# Altium schematic sheet 12_Coral_Edge_TPU.SchDoc: Coral Edge TPU
size 420 x 297 mm; Author: Lukas Henkel; DocumentNumber: 12; SheetNumber: 12; SheetTotal: 16; DocSize: A3
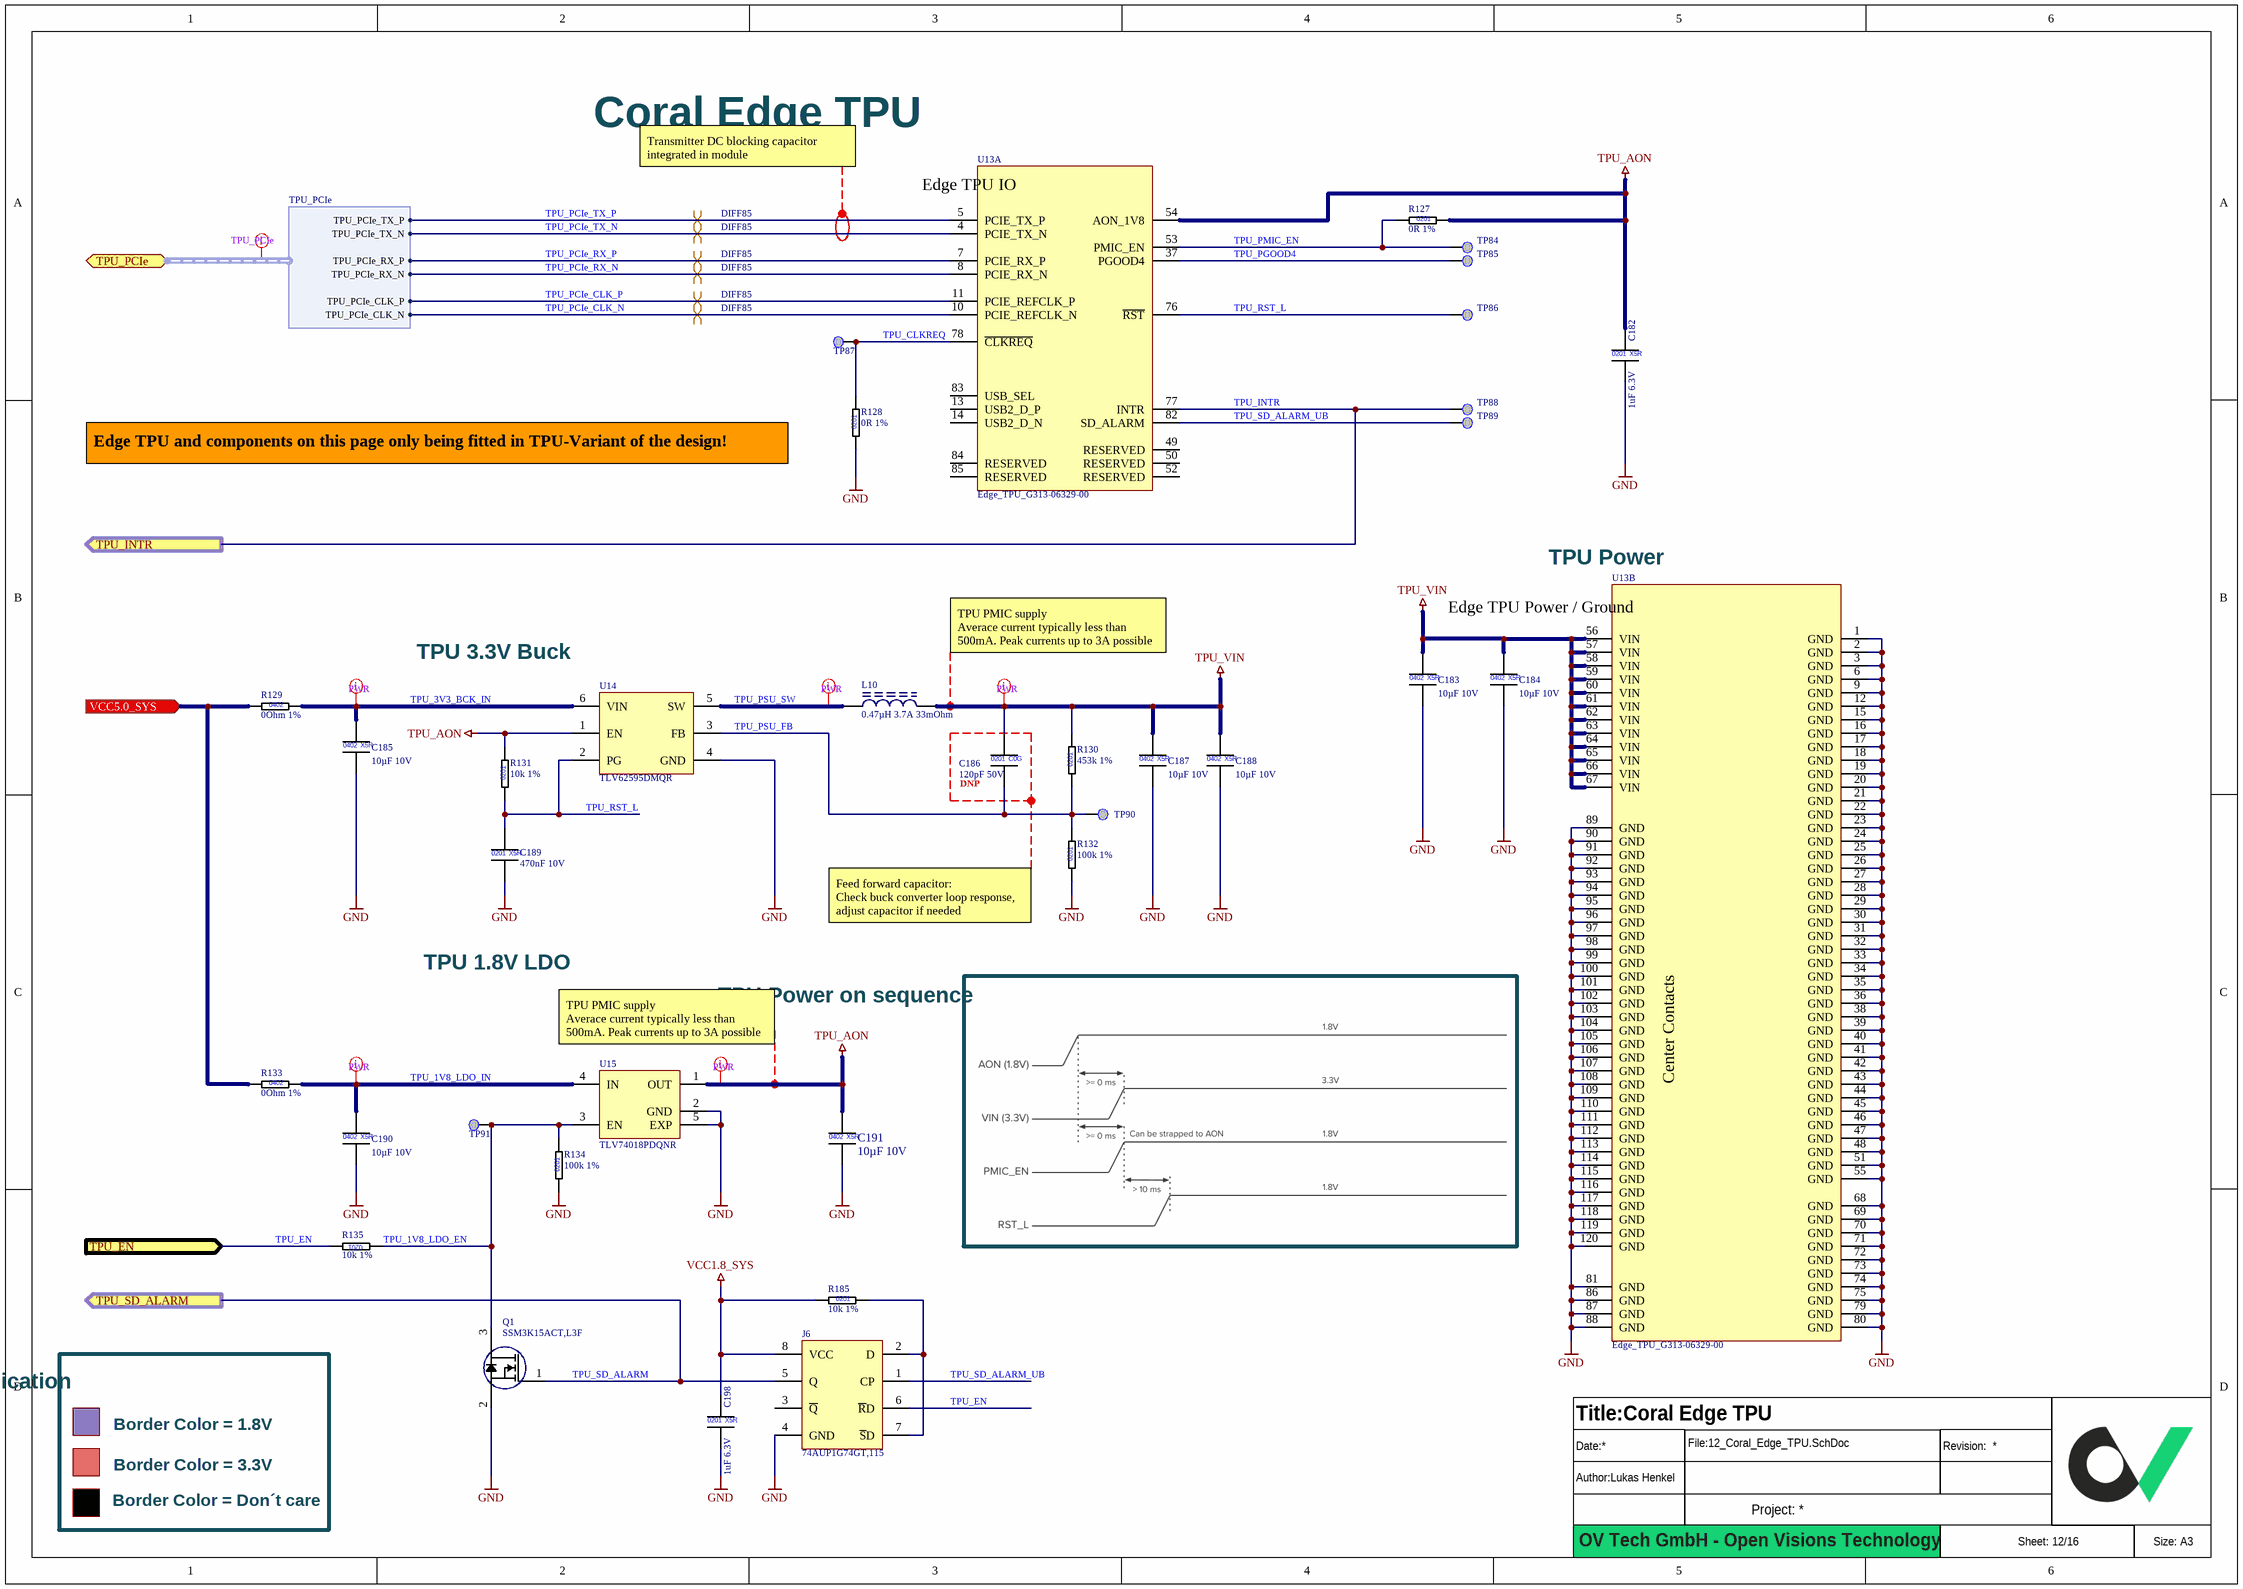
[diagram p0: 12_Coral_Edge_TPU.SchDoc]

## Parts
?  (no value)  (graphical)
C182  1uF 6.3V  [CAPC0603X03L]
C183  10µF 10V  [CAPC1005X06L]
C184  10µF 10V  [CAPC1005X06L]
C185  10µF 10V  [CAPC1005X06L]
C186  120pF 50V  [CAPC0603X03L]
C187  10µF 10V  [CAPC1005X06L]
C188  10µF 10V  [CAPC1005X06L]
C189  470nF 10V  [CAPC0603X03L]
C190  10µF 10V  [CAPC1005X06L]
C191  10µF 10V  [CAPC1005X06L]
C198  1uF 6.3V  [CAPC0603X03L]
J6  74AUP1G74GT,115  [PSON50P100X50-8L]
L10  0.47µH 3.7A 33mOhm  [INDC2016X12L]
Q1  SSM3K15ACT,L3F  [DFN65P100X50-3L]
R127  0R 1%  [RESC0603X03L]
R128  0R 1%  [RESC0603X03L]
R129  0Ohm 1%  [RESC1005X04L]
R130  453k 1%  [RESC0603X03L]
R131  10k 1%  [RESC0603X03L]
R132  100k 1%  [RESC0603X03L]
R133  0Ohm 1%  [RESC1005X04L]
R134  100k 1%  [RESC0603X03L]
R135  10k 1%  [RESC0603X03L]
R185  10k 1%  [RESC0603X03L]
TP84  Testpoint 0.5mm  [TP_0.50mm]  (value not drawn)  (no BOM)
TP85  Testpoint 0.5mm  [TP_0.50mm]  (value not drawn)  (no BOM)
TP86  Testpoint 0.5mm  [TP_0.50mm]  (value not drawn)  (no BOM)
TP87  Testpoint 0.5mm  [TP_0.50mm]  (value not drawn)  (no BOM)
TP88  Testpoint 0.5mm  [TP_0.50mm]  (value not drawn)  (no BOM)
TP89  Testpoint 0.5mm  [TP_0.50mm]  (value not drawn)  (no BOM)
TP90  Testpoint 0.5mm  [TP_0.50mm]  (value not drawn)  (no BOM)
TP91  Testpoint 0.5mm  [TP_0.50mm]  (value not drawn)  (no BOM)
U13  Edge_TPU_G313-06329-00  [LGA120C50P19X22_1000X1500X150]  (parts A,B of 2)
U14  TLV62595DMQR  [VSON50P150X150X100_HS-6L]
U15  TLV74018PDQNR  [X2SON-DFN]

## Blocks framed on the sheet
DNP: C186

## Ports
TPU_EN (in), TPU_INTR (out), TPU_PCIe (bidir, harness TPU_PCIe), TPU_SD_ALARM (out), VCC5.0_SYS (in)

## Harnesses
TPU_PCIe: TPU_PCIe_TX_P, TPU_PCIe_TX_N, TPU_PCIe_RX_P, TPU_PCIe_RX_N, TPU_PCIe_CLK_P, TPU_PCIe_CLK_N

## Nets
GND: C182.2 C183.2 C184.2 C185.2 C187.2 C188.2 C189.2 C190.2 C191.2 C198.2 J6.4(GND) Q1.2(S) R128.1 R132.1 R134.1 U13.1(GND) U13.2(GND) U13.3(GND) U13.6(GND) U13.9(GND) U13.12(GND) U13.15(GND) U13.16(GND) U13.17(GND) U13.18(GND) U13.19(GND) U13.20(GND) U13.21(GND) U13.22(GND) U13.23(GND) U13.24(GND) U13.25(GND) U13.26(GND) U13.27(GND) U13.28(GND) U13.29(GND) U13.30(GND) U13.31(GND) U13.32(GND) U13.33(GND) U13.34(GND) U13.35(GND) U13.36(GND) U13.38(GND) U13.39(GND) U13.40(GND) U13.41(GND) U13.42(GND) U13.43(GND) U13.44(GND) U13.45(GND) U13.46(GND) U13.47(GND) U13.48(GND) U13.51(GND) U13.55(GND) U13.68(GND) U13.69(GND) U13.70(GND) U13.71(GND) U13.72(GND) U13.73(GND) U13.74(GND) U13.75(GND) U13.79(GND) U13.80(GND) U13.81(GND) U13.86(GND) U13.87(GND) U13.88(GND) U13.89(GND) U13.90(GND) U13.91(GND) U13.92(GND) U13.93(GND) U13.94(GND) U13.95(GND) U13.96(GND) U13.97(GND) U13.98(GND) U13.99(GND) U13.100(GND) U13.101(GND) U13.102(GND) U13.103(GND) U13.104(GND) U13.105(GND) U13.106(GND) U13.107(GND) U13.108(GND) U13.109(GND) U13.110(GND) U13.111(GND) U13.112(GND) U13.113(GND) U13.114(GND) U13.115(GND) U13.116(GND) U13.117(GND) U13.118(GND) U13.119(GND) U13.120(GND) U14.4(GND) U15.2(GND) U15.5(EXP)
TPU_AON: C182.1 C191.1 R127.2 R131.2 U13.54(AON_1V8) U14.1(EN) U15.1(OUT)
TPU_VIN: C183.1 C184.1 C186.1 C187.1 C188.1 L10.2 R130.2 U13.56(VIN) U13.57(VIN) U13.58(VIN) U13.59(VIN) U13.60(VIN) U13.61(VIN) U13.62(VIN) U13.63(VIN) U13.64(VIN) U13.65(VIN) U13.66(VIN) U13.67(VIN)
VCC1.8_SYS: C198.1 J6.8(VCC) R185.1
TPU_1V8_LDO_EN: Q1.3(D) R134.2 R135.1 TP91.TP U15.3(EN)
TPU_1V8_LDO_IN: C190.1 R133.2 U15.4(IN)
TPU_3V3_BCK_IN: C185.1 R129.2 U14.6(VIN)
TPU_CLKREQ: R128.2 TP87.TP U13.78(~{CLKREQ})
TPU_EN: J6.6(~{R}D) R135.2 ; port TPU_EN
TPU_INTR: TP88.TP U13.77(INTR) ; port TPU_INTR
TPU_PCIe_CLK_N: U13.10(PCIE_REFCLK_N) ; port TPU_PCIe.TPU_PCIe_CLK_N
TPU_PCIe_CLK_P: U13.11(PCIE_REFCLK_P) ; port TPU_PCIe.TPU_PCIe_CLK_P
TPU_PCIe_RX_N: U13.8(PCIE_RX_N) ; port TPU_PCIe.TPU_PCIe_RX_N
TPU_PCIe_RX_P: U13.7(PCIE_RX_P) ; port TPU_PCIe.TPU_PCIe_RX_P
TPU_PCIe_TX_N: U13.4(PCIE_TX_N) ; port TPU_PCIe.TPU_PCIe_TX_N
TPU_PCIe_TX_P: U13.5(PCIE_TX_P) ; port TPU_PCIe.TPU_PCIe_TX_P
TPU_PGOOD4: TP85.TP U13.37(PGOOD4)
TPU_PMIC_EN: R127.1 TP84.TP U13.53(PMIC_EN)
TPU_PSU_FB: C186.2 R130.1 R132.2 TP90.TP U14.3(FB)
TPU_PSU_SW: L10.1 U14.5(SW)
TPU_RST_L: C189.1 R131.1 TP86.TP U13.76(~{RST}) U14.2(PG)
TPU_SD_ALARM: J6.5(Q) Q1.1(G) ; port TPU_SD_ALARM
TPU_SD_ALARM_UB: J6.1(CP) TP89.TP U13.82(SD_ALARM)
VCC5.0_SYS: R129.1 R133.1 ; port VCC5.0_SYS
NetJ6_2: J6.2(D) J6.7(~{S}D) R185.2

Not connected (* = marked no-connect by the designer): J6 3(~{Q}); U13 13(USB2_D_P) 14(USB2_D_N) 49(RESERVED) 50(RESERVED) 52(RESERVED) 83(USB_SEL) 84(RESERVED) 85(RESERVED)

## Layout directives
net class PWR: TPU_1V8_LDO_IN, TPU_3V3_BCK_IN, TPU_AON, TPU_PSU_SW, TPU_VIN
net class TPU_PCIe: (no net found under the mark)
differential pair; differential pair class DIFF85: TPU_PCIe_CLK_N, TPU_PCIe_CLK_P, TPU_PCIe_RX_N, TPU_PCIe_RX_P, TPU_PCIe_TX_N, TPU_PCIe_TX_P

## Notes on the sheet
- Coral Edge TPU
- Transmitter DC blocking capacitor integrated in module
- Edge TPU and components on this page only being fitted in TPU-Variant of the design!
- TPU Power
- (near U14) TPU 3.3V Buck
- TPU PMIC supply
  Averace current typically less than 500mA. Peak currents up to 3A possible
- (near R132) Feed forward capacitor:
  Check buck converter loop response, adjust capacitor if needed
- TPU 1.8V LDO
- TPU Power on sequence
- (near U15) TPU PMIC supply
  Averace current typically less than 500mA. Peak currents up to 3A possible
- Signal Level Indication
- Border Color = 1.8V
- Border Color = 3.3V
- Border Color = Don´t care
- OV Tech GmbH - Open Visions Technology
- (in symbol CAP_0201_1uF_6.3V) 0201; X5R
- (in symbol CAP_0201_120pF_50V) 0201; C0G
- (in symbol CAP_0201_470nF_10V) 0201; X5R
- (in symbol CAP_0402_10µ_10V) 0402; X5R
- (in symbol RES_0201_0R_1%) 0201
- (in symbol RES_0201_10k_1%) 0201
- (in symbol RES_0201_100k_1%) 0201
- (in symbol RES_0201_453k_1%) 0201
- (in symbol RES_0402_0R_1%) 0402
- (in symbol TPU_Google_Edge_TPU, part A) Edge TPU IO
- (in symbol TPU_Google_Edge_TPU, part B) Edge TPU Power / Ground; Center Contacts

## Library data of the parts
? = Titleblock_01_OpenSource
C182 C198 = CAP_0201_1uF_6.3V: Multilayer Ceramic Capacitors MLCC - SMD/SMT 0201 6.3VDC; Manufacturer 1: Murata Electronics; Manufacturer 1 Prt. Nr.: GRM033R60J105MEA2D; Manufacturer 2 Prt. Nr.: CL03A105MQ3CSNC; Manufacturer 2: Samsung Electro-Mechanics
C183-C185 C187 C188 C190 C191 = CAP_0402_10µ_10V: Multilayer Ceramic Capacitors MLCC - SMD/SMT 0402 10VDC; Manufacturer 1: Murata Electronics; Manufacturer 1 Prt. Nr.: GRM155R61A106ME11D; Manufacturer 2 Prt. Nr.: 0402ZD106MAT4A; Manufacturer 2: KYOCERA AVX
C186 = CAP_0201_120pF_50V: Multilayer Ceramic Capacitors MLCC - SMD/SMT 0201 50VDC; Manufacturer 1: Murata Electronics; Manufacturer 1 Prt. Nr.: GRT0335C1H121FA02D; Manufacturer 2 Prt. Nr.: GRM0335C1H121FA01D; Manufacturer 2: Murata Electronics
C189 = CAP_0201_470nF_10V: Multilayer Ceramic Capacitors MLCC - SMD/SMT 0201 10VDC; Manufacturer 1: Taiyo Yuden; Manufacturer 1 Prt. Nr.: LMK063BBJ474KPLF; Manufacturer 2 Prt. Nr.: C0603X5R1A474M030BC; Manufacturer 2: TDK
J6 = D-FLOP_SMG-W-2,0x1,2x1,25-AU: D-type flip-flop with differential output and async set- and reset input; Manufacturer 1: Nexperia; Manufacturer 1 Prt. Nr.: 74AUP1G74GT,115
L10 = IND_DFE-P 2016_0.47µH_3.7A: Fixed Inductors DFE-P 2016 0.47uH 3.7A 20% 33mOhms HiCur; Manufacturer 1 Prt. Nr.: DFE201612P-R47M=P2; Manufacturer 1: Murata Electronics
Q1 = N-Channel MOSFET_SSM3K15ACT,L3F: MOSFET 30V SGL N-CH TRENCHMOS Logic Level; Manufacturer 1: Toshiba; Manufacturer 1 Prt. Nr.: SSM3K15ACT,L3F
R127 R128 = RES_0201_0R_1%: Thick Film Resistors - SMD 0R OHM 1%; Manufacturer 1: Yageo; Manufacturer 1 Prt. Nr.: RC0201FR-070RL; Manufacturer 2 Prt. Nr.: CRCW02010000Z0ED; Manufacturer 2: Vishay / Dale
R129 R133 = RES_0402_0R_1%: Thick Film Resistors - SMD 0OHM 1%; Manufacturer 1: Bourns; Manufacturer 1 Prt. Nr.: CR0402AJ/-000GAS; Manufacturer 2 Prt. Nr.: AC0402FR-070RL; Manufacturer 2: YAGEO
R130 = RES_0201_453k_1%: Thick Film Resistors - SMD 453K OHM 1%; Manufacturer 1: Yageo; Manufacturer 1 Prt. Nr.: RC0201FR-07453KL; Manufacturer 2 Prt. Nr.: CRCW0201453KFKED; Manufacturer 2: Vishay / Dale
R131 R135 R185 = RES_0201_10k_1%: Thick Film Resistors - SMD 10K OHM 1%; Manufacturer 1: Yageo; Manufacturer 1 Prt. Nr.: RC0201FR-0710KL; Manufacturer 2 Prt. Nr.: CRCW020110K0FNED; Manufacturer 2: Vishay / Dale
R132 R134 = RES_0201_100k_1%: Thick Film Resistors - SMD 100K OHM 1%; Manufacturer 1: Yageo; Manufacturer 1 Prt. Nr.: RC0201FR-07100KL; Manufacturer 2 Prt. Nr.: CRCW0201100KFNED; Manufacturer 2: Vishay / Dale
U13 = TPU_Google_Edge_TPU: Google Coral accelerator module, 4TOPs peak performace, PCIe Gen 2x1 & USB2.0 HS; Manufacturer: Coral; Manufacturer Part Number: G313-06329-00
U14 = Buck 4A 5.5V_TLV62595DMQR: 5.5V, 4A, Adjustable ,Synchronous Buck Converter; Manufacturer 1: Texas Instruments; Manufacturer 1 Prt. Nr.: TLV62595DMQR
U15 = LDO 1.8V_TLV74018PDQNR: LDO voltage regulator 300mA X2SON; Manufacturer 1: Texas Instruments; Manufacturer 1 Prt. Nr.: TLV74018PDQNR